# EAGLE schematic led driver (EAGLE 7.2.0)
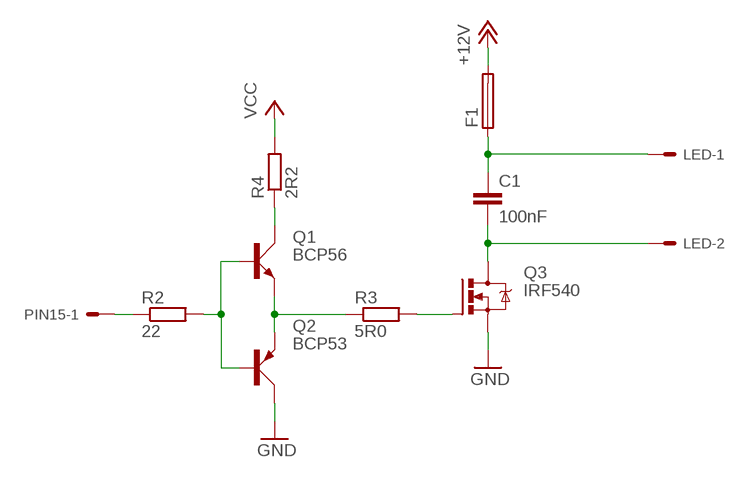
[diagram p0: schematic, sheet 1]

## Parts
C1  100nF  C2,5-3  [C2.5-3]
F1  TE5  [TE5]
LED  5566-10  [5566-10]
PIN15  5566-10  [5566-10]
Q1  BCP56  BC639  [SOT54D]
Q2  BCP53  BC640  [SOT54D]
Q3  IRF540  [TO220BV]
R2  22  R-EU_R1206  [R1206]
R3  5R0  R-EU_R1206  [R1206]
R4  2R2  R-EU_R1206  [R1206]

## Nets
+12V: F1.2
GND: Q2.C Q3.S
N$5: Q1.B Q2.B R2.2
N$6: PIN15.1 R2.1
N$8: Q1.E Q2.E R3.1
N$9: Q3.G R3.2
N$10: C1.2 LED.2 Q3.D
N$12: Q1.C R4.1
N$13: C1.1 F1.1 LED.1
VCC: R4.2
Unconnected: LED.3 LED.4 LED.5 LED.6 LED.7 LED.8 LED.9 LED.10 PIN15.2 PIN15.3 PIN15.4 PIN15.5 PIN15.6 PIN15.7 PIN15.8 PIN15.9 PIN15.10

## Library data of the parts
C1 = capacitor-wima:C: CAPACITOR naming: grid - package width
F1 = fuse:TE5: FUSE Wickmann; OC_FARNELL: unknown; OC_NEWARK: unknown
LED PIN15 = con-molex:5566-10: Mini FIT connector 10 pol Source: http://www.molex.com; OC_FARNELL: unknown; OC_NEWARK: unknown
Q1 = transistor-small-signal:BC639: NPN TRANSISTOR
Q2 = transistor-small-signal:BC640: PNP TRANSISTOR
Q3 = transistor-power:IRF540: HEXFET Power MOSFET
R2-R4 = resistor:R-EU_: RESISTOR, European symbol